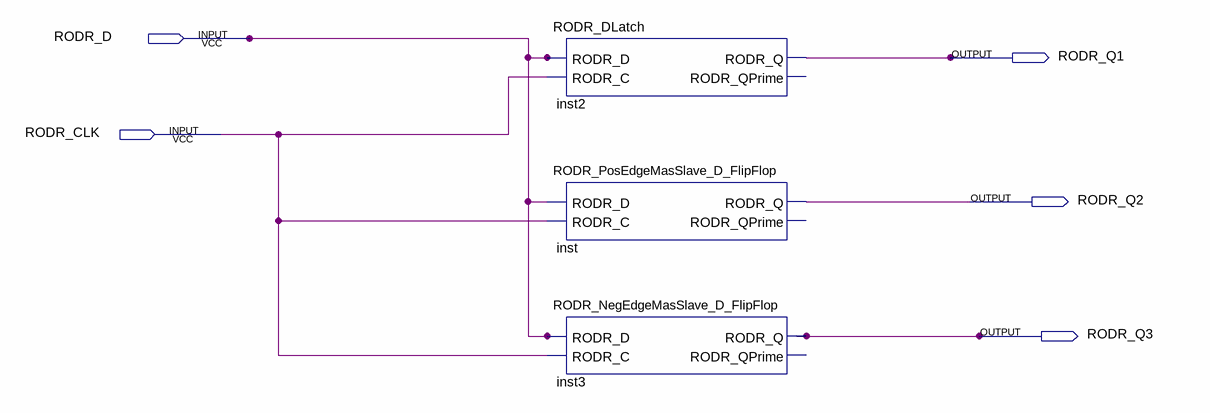
[diagram p0: schematic sheet]
// Quartus schematic RODR_D_Comparison.bdf as structural Verilog: 3 symbols, 5 pins
module RODR_D_Comparison (
  input  RODR_D,
  input  RODR_CLK,
  output RODR_Q1,
  output RODR_Q2,
  output RODR_Q3
);

  RODR_DLatch inst2 (.RODR_D(RODR_D), .RODR_C(RODR_CLK), .RODR_Q(RODR_Q1));  // open: RODR_QPrime
  RODR_PosEdgeMasSlave_D_FlipFlop inst (.RODR_D(RODR_D), .RODR_C(RODR_CLK), .RODR_Q(RODR_Q2));  // open: RODR_QPrime
  RODR_NegEdgeMasSlave_D_FlipFlop inst3 (.RODR_D(RODR_D), .RODR_C(RODR_CLK), .RODR_Q(RODR_Q3));  // open: RODR_QPrime
endmodule
